# Altium schematic sheet K64f_XFBGA_121_pin.SchDoc
size A3
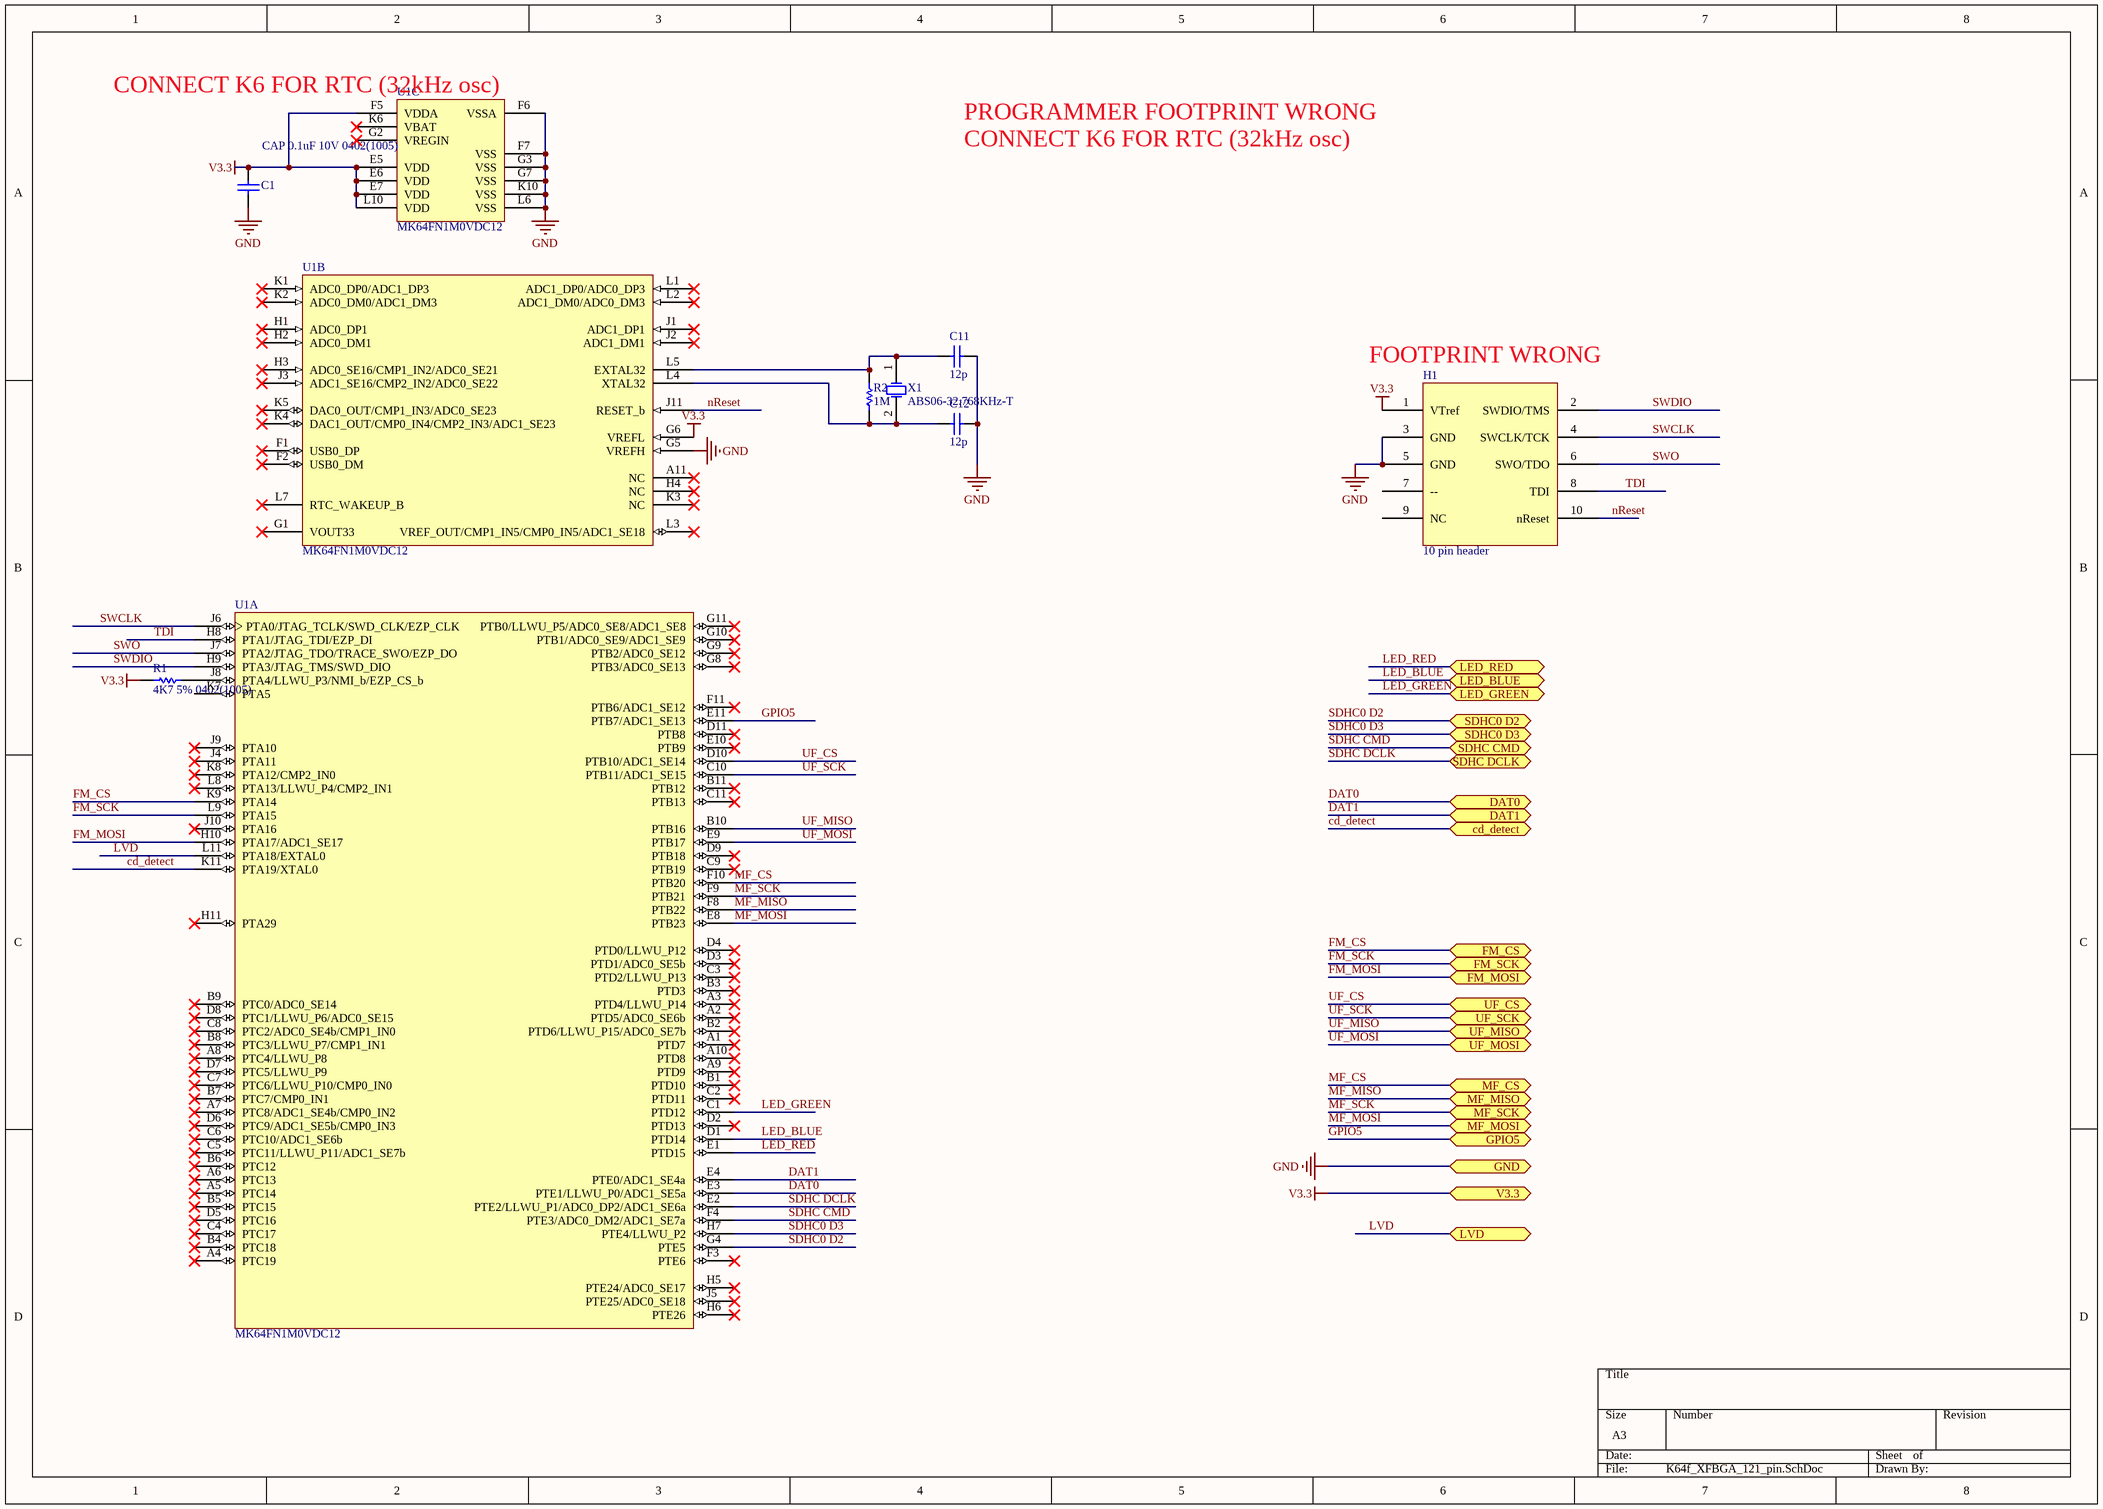
[diagram p0: K64f_XFBGA_121_pin.SchDoc]

## Parts
C1  CAP 0.1uF 10V 0402(1005)  [CAPC0402(1005)60_M]
C11  12p  [CAPC0402(1005)60_M]
C12  12p  [CAPC0402(1005)60_M]
H1  10 pin header  [SAM8795-ND]
R1  4K7 5% 0402(1005)  [RESC0402(1005)_L]
R2  1M  [RESC0402(1005)_L]
U1  MK64FN1M0VDC12  [FRES-MAPBGA-121]  (parts A,B,C of 3)
X1  ABS06-32.768KHz-T  [0805]

## Ports
cd_detect, DAT0, DAT1, FM_CS, FM_MOSI, FM_SCK, GND, GPIO5, LED_BLUE, LED_GREEN, LED_RED, LVD, MF_CS, MF_MISO, MF_MOSI, MF_SCK, SDHC0 D2, SDHC0 D3, SDHC CMD, SDHC DCLK, UF_CS, UF_MISO, UF_MOSI, UF_SCK, V3.3

## Nets
GND: C1.1 C11.1 C12.1 H1.3(GND) H1.5(GND) U1.F6(VSSA) U1.F7(VSS) U1.G3(VSS) U1.G5(VREFH) U1.G7(VSS) U1.K10(VSS) U1.L6(VSS) ; port GND
V3.3: C1.2 H1.1(VTref) R1.1 U1.E5(VDD) U1.E6(VDD) U1.E7(VDD) U1.F5(VDDA) U1.G6(VREFL) U1.L10(VDD) ; port V3.3
cd_detect: U1.K11(PTA19/XTAL0) ; port cd_detect
DAT0: U1.E3(PTE1/LLWU_P0/ADC1_SE5a) ; port DAT0
DAT1: U1.E4(PTE0/ADC1_SE4a) ; port DAT1
FM_CS: U1.K9(PTA14) ; port FM_CS
FM_MOSI: U1.H10(PTA17/ADC1_SE17) ; port FM_MOSI
FM_SCK: U1.L9(PTA15) ; port FM_SCK
GPIO5: U1.E11(PTB7/ADC1_SE13) ; port GPIO5
LED_BLUE: U1.D1(PTD14) ; port LED_BLUE
LED_GREEN: U1.C1(PTD12) ; port LED_GREEN
LED_RED: U1.E1(PTD15) ; port LED_RED
LVD: U1.L11(PTA18/EXTAL0) ; port LVD
MF_CS: U1.F10(PTB20) ; port MF_CS
MF_MISO: U1.F8(PTB22) ; port MF_MISO
MF_MOSI: U1.E8(PTB23) ; port MF_MOSI
MF_SCK: U1.F9(PTB21) ; port MF_SCK
nReset: H1.10(nReset) U1.J11(RESET_b)
SDHC0 D2: U1.G4(PTE5) ; port SDHC0 D2
SDHC0 D3: U1.H7(PTE4/LLWU_P2) ; port SDHC0 D3
SDHC CMD: U1.F4(PTE3/ADC0_DM2/ADC1_SE7a) ; port SDHC CMD
SDHC DCLK: U1.E2(PTE2/LLWU_P1/ADC0_DP2/ADC1_SE6a) ; port SDHC DCLK
SWCLK: H1.4(SWCLK/TCK) U1.J6(PTA0/JTAG_TCLK/SWD_CLK/EZP_CLK)
SWDIO: H1.2(SWDIO/TMS) U1.H9(PTA3/JTAG_TMS/SWD_DIO)
SWO: H1.6(SWO/TDO) U1.J7(PTA2/JTAG_TDO/TRACE_SWO/EZP_DO)
TDI: H1.8(TDI) U1.H8(PTA1/JTAG_TDI/EZP_DI)
UF_CS: U1.D10(PTB10/ADC1_SE14) ; port UF_CS
UF_MISO: U1.B10(PTB16) ; port UF_MISO
UF_MOSI: U1.E9(PTB17) ; port UF_MOSI
UF_SCK: U1.C10(PTB11/ADC1_SE15) ; port UF_SCK
NetC11_2: C11.2 R2.1 U1.L5(EXTAL32) X1.1(X1)
NetC12_2: C12.2 R2.2 U1.L4(XTAL32) X1.2(X2)
NetR1_2: R1.2 U1.J8(PTA4/LLWU_P3/NMI_b/EZP_CS_b)

Not connected (* = marked no-connect by the designer): H1 7(--) 9(NC); U1 A1(PTD7)* A2(PTD5/ADC0_SE6b)* A3(PTD4/LLWU_P14)* A4(PTC19)* A5(PTC14)* A6(PTC13)* A7(PTC8/ADC1_SE4b/CMP0_IN2)* A8(PTC4/LLWU_P8)* A9(PTD9)* A10(PTD8)* A11(NC)* B1(PTD10)* B2(PTD6/LLWU_P15/ADC0_SE7b)* B3(PTD3)* B4(PTC18)* B5(PTC15)* B6(PTC12)* B7(PTC7/CMP0_IN1)* B8(PTC3/LLWU_P7/CMP1_IN1)* B9(PTC0/ADC0_SE14)* B11(PTB12)* C2(PTD11)* C3(PTD2/LLWU_P13)* C4(PTC17)* C5(PTC11/LLWU_P11/ADC1_SE7b)* C6(PTC10/ADC1_SE6b)* C7(PTC6/LLWU_P10/CMP0_IN0)* C8(PTC2/ADC0_SE4b/CMP1_IN0)* C9(PTB19)* C11(PTB13)* D2(PTD13)* D3(PTD1/ADC0_SE5b)* D4(PTD0/LLWU_P12)* D5(PTC16)* D6(PTC9/ADC1_SE5b/CMP0_IN3)* D7(PTC5/LLWU_P9)* D8(PTC1/LLWU_P6/ADC0_SE15)* D9(PTB18)* D11(PTB8)* E10(PTB9)* F1(USB0_DP)* F2(USB0_DM)* F3(PTE6)* F11(PTB6/ADC1_SE12)* G1(VOUT33)* G2(VREGIN)* G8(PTB3/ADC0_SE13)* G9(PTB2/ADC0_SE12)* G10(PTB1/ADC0_SE9/ADC1_SE9)* G11(PTB0/LLWU_P5/ADC0_SE8/ADC1_SE8)* H1(ADC0_DP1)* H2(ADC0_DM1)* H3(ADC0_SE16/CMP1_IN2/ADC0_SE21)* H4(NC)* H5(PTE24/ADC0_SE17)* H6(PTE26)* H11(PTA29)* J1(ADC1_DP1)* J2(ADC1_DM1)* J3(ADC1_SE16/CMP2_IN2/ADC0_SE22)* J4(PTA11)* J5(PTE25/ADC0_SE18)* J9(PTA10)* J10(PTA16)* K1(ADC0_DP0/ADC1_DP3)* K2(ADC0_DM0/ADC1_DM3)* K3(NC)* K4(DAC1_OUT/CMP0_IN4/CMP2_IN3/ADC1_SE23)* K5(DAC0_OUT/CMP1_IN3/ADC0_SE23)* K6(VBAT)* K7(PTA5) K8(PTA12/CMP2_IN0)* L1(ADC1_DP0/ADC0_DP3)* L2(ADC1_DM0/ADC0_DM3)* L3(VREF_OUT/CMP1_IN5/CMP0_IN5/ADC1_SE18)* L7(RTC_WAKEUP_B)* L8(PTA13/LLWU_P4/CMP2_IN1)*

## Notes on the sheet
- (near U1) CONNECT K6 FOR RTC (32kHz osc)
- PROGRAMMER FOOTPRINT WRONG
- CONNECT K6 FOR RTC (32kHz osc)
- (near H1) FOOTPRINT WRONG

## Library data of the parts
C1 = CMP-1034-00013-1: 0.1uF; Case-Metric: 1005; Tolerance: Â±0.1pF; Case-EIA: 0402; Value: 0.1uF; Max Thickness: 0.6 mm; Rated Voltage: 10 V; Technology: SMT
C11 C12 = CMP-1034-00013-1: CAP 12pF 10V ±0.1pF 0402 (1005 Metric) Thickness 0.6mm SMD; Value: 0.5pF; Case-Metric: 1005; Tolerance: Â±0.1pF; Case-EIA: 0402; Max Thickness: 0.6 mm; Rated Voltage: 10 V; Technology: SMT
H1 = SAM8795-ND: 10 pin programming header SAM8795-ND
R1 = CMP-1011-00090-1: 4K7 0.063W 5% 0402 (1005 Metric)  SMD; Value: 4700.00 Ohm; Case-Metric: 1005; Case-EIA: 0402; Tolerance: 5 %; Power: 0.063 W; Technology: SMT
R2 = CMP-1011-00090-1: 1M 0.063W 5% 0402 (1005 Metric)  SMD; Value: 4700.00 Ohm; Case-Metric: 1005; Case-EIA: 0402; Tolerance: 5 %; Power: 0.063 W; Technology: SMT
U1 = CMP-0182-00050-2: Cortex-M4-based Microcontroller with FPU, 1 MB, 120 MHz, 1.71 to 3.6 V, -40 to 105 degC, 121-Ball MAPBGA, RoHS, Tray; Manufacturer: Freescale Semiconductor; SRAM: 256 KB; Flash: 1 MB; ComponentLink3URL: http://cache.freescale.com/files/shared/doc/package_info/98ASA00595D.pdf; PackageDescription: 121-Ball Mold Array Process Ball Grid Array, Body 8 x 8 mm, Pitch 0.65 mm; ComponentLink3Description: Package Specification; ComponentLink1URL: http://www.freescale.com/; Temperature Range: -40 to 105 degC; DatasheetVersion: Rev. 3; Packing: Tray; VDD: 1.71 to 3.6 V; ComponentLink2URL: http://cache.freescale.com/files/microcontrollers/doc/data_sheet/K64P144M120SF5.pdf?pspll=1; Mounting Technology: Surface Mount; VBAT: 1.71 to 3.6 V; ComponentLink1Description: Manufacturer URL; VDDA: 1.71 to 3.6 V; ComponentLink2Description: Datasheet; RoHS: TRUE; PackageVersion: Rev. O; PartNumber: MK64FN1M0VDC12; PartId: 1
X1 = CMP-0463-00001-2: Crystals 32.768KHz 20ppm 12.5pF -40C +85C 0805(2012); PartNumber: 14340272-32.768KHz; Manufacturer: ITTI; Frequency Tolerance: +/-20 ppm; Drive Level: 1 max. uw; Nominal Frequency: 32.768KHz; Mounting Technology: Surface Mount; Operating temperature: -40 to 85 degC; ComponentLink1URL: http://www.itti-co.com; Load Capacitance: 12.5 pF; ComponentLink1Description: Manufacturer URL; PackageReference: 14340272-32.768KHz-2; PackageDescription: 2-Pin Hand Drawn, Body 3.2 x 1.5mm, Pitch 2.5 mm